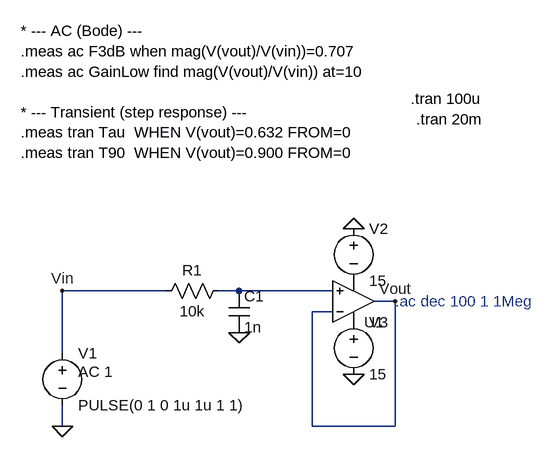
[diagram p0: schematic Filter_project1.asc]
Filter_project1.asc, the LTspice schematic file:
Version 4.1
SHEET 1 1208 680
WIRE 464 -352 304 -352
WIRE 576 -352 544 -352
WIRE 720 -352 576 -352
WIRE 816 -336 784 -336
WIRE 720 -320 688 -320
WIRE 304 -256 304 -352
WIRE 304 -144 304 -176
WIRE 688 -144 688 -320
WIRE 816 -144 816 -336
WIRE 816 -144 688 -144
FLAG 304 -144 0
FLAG 304 -352 Vin
FLAG 576 -288 0
FLAG 816 -336 Vout
FLAG 752 -448 0
FLAG 752 -224 0
SYMBOL voltage 304 -272 R0
WINDOW 123 24 44 Left 2
WINDOW 39 0 0 Left 0
SYMATTR Value2 AC 1
SYMATTR InstName V1
SYMATTR Value PULSE(0 1 0 1u 1u 1 1)
SYMBOL res 560 -368 R90
WINDOW 0 0 56 VBottom 2
WINDOW 3 32 56 VTop 2
SYMATTR InstName R1
SYMATTR Value 10k
SYMBOL cap 560 -352 R0
SYMATTR InstName C1
SYMATTR Value 1n
SYMBOL OpAmps\\UniversalOpAmp2 752 -336 M180
SYMATTR InstName U1
SYMBOL voltage 752 -464 R0
WINDOW 123 0 0 Left 0
WINDOW 39 0 0 Left 0
SYMATTR InstName V2
SYMATTR Value 15
SYMBOL voltage 752 -320 R0
WINDOW 123 0 0 Left 0
WINDOW 39 0 0 Left 0
SYMATTR InstName V3
SYMATTR Value 15
TEXT 816 -336 Left 2 ;.ac dec 100 1 1Meg
TEXT 840 -648 Left 2 !.tran 100u
TEXT 240 -752 Left 2 !* --- AC (Bode) ---\n.meas ac F3dB when mag(V(vout)/V(vin))=0.707\n.meas ac GainLow find mag(V(vout)/V(vin)) at=10\n \n* --- Transient (step response) ---\n.meas tran Tau  WHEN V(vout)=0.632 FROM=0\n.meas tran T90  WHEN V(vout)=0.900 FROM=0
TEXT 848 -616 Left 2 !.tran 20m

The netlist it stands for:
* Filter_project1.asc
V1 Vin 0 PULSE(0 1 0 1u 1u 1 1) AC 1
R1 N001 Vin 10k
C1 N001 0 1n
X§U1 N001 Vout P001 P002 Vout level2 Avol=1Meg GBW=10Meg Slew=10Meg Ilimit=25m Rail=0 Vos=0 En=0 Enk=0 In=0 Ink=0 Rin=500Meg  ; pins In+ In- V+ V- OUT
V2 0 P002 15
V3 P001 0 15
* .ac dec 100 1 1Meg
.tran 100u
* --- AC (Bode) ---
.meas ac F3dB when mag(V(vout)/V(vin))=0.707
.meas ac GainLow find mag(V(vout)/V(vin)) at=10
* --- Transient (step response) ---
.meas tran Tau  WHEN V(vout)=0.632 FROM=0
.meas tran T90  WHEN V(vout)=0.900 FROM=0
.tran 20m
.lib UniversalOpAmp2.lib
.backanno
.end